# EAGLE schematic OliPCBv1 (EAGLE 9.6.2)
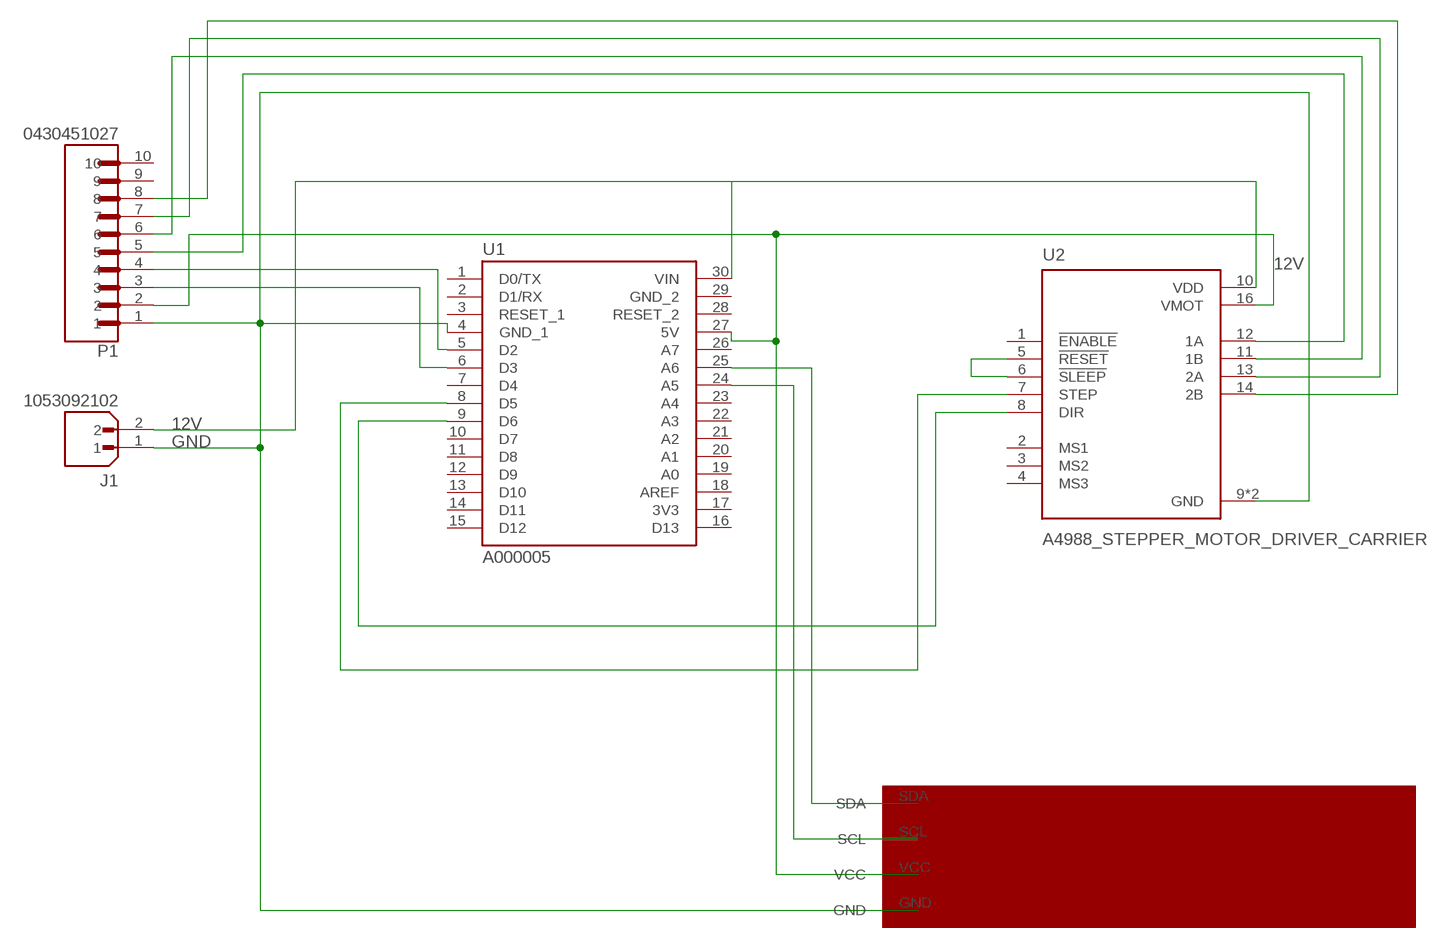
[diagram p0: schematic, sheet 1]

## Parts
J1  1053092102  [MOLEX_1053092102]
P1  0430451027  [MOLEX_0430451027]
U1  A000005  [MODULE_A000005]
U2  A4988_STEPPER_MOTOR_DRIVER_CARRIER  [MODULE_A4988_STEPPER_MOTOR_DRIVER_CARRIER]
U$1  WYTP61_DEVICE  [WTYP61]

## Nets
12V: J1.2 U1.30(VIN) U2.10(VDD)
GND: J1.1 P1.1 U1.4(GND_1) U2.9(GND) U2.15(GND) U$1.GND
N$1: U1.9(D6) U2.8(DIR)
N$2: U1.8(D5) U2.7(STEP)
N$3: U1.24(A5) U$1.SCL
N$4: U1.25(A6) U$1.SDA
N$5: P1.2 U1.27(5V) U2.16(VMOT) U$1.VCC
N$6: P1.3 U1.6(D3)
N$7: P1.4 U1.5(D2)
N$8: P1.5 U2.12(1A)
N$10: P1.6 U2.11(1B)
N$11: P1.7 U2.13(2A)
N$12: P1.8 U2.14(2B)
N$13: U2.5(!RESET) U2.6(!SLEEP)
Unconnected: P1.9 P1.10 U1.1(D0/TX) U1.2(D1/RX) U1.3(RESET_1) U1.7(D4) U1.10(D7) U1.11(D8) U1.12(D9) U1.13(D10) U1.14(D11) U1.15(D12) U1.16(D13) U1.18(AREF) U1.19(A0) U1.20(A1) U1.21(A2) U1.22(A3) U1.23(A4) U1.26(A7) U1.28(RESET_2) U2.1(!ENABLE) U2.2(MS1) U2.3(MS2) U2.4(MS3)

## Power pins joined to a net without a drawn wire
3V3: U1.17(3V3)
GND_2: U1.29(GND_2)

## Library data of the parts
J1 = Molex Power:1053092102: Nano-Fit Vertical Header, Through Hole, 2.50mm Pitch, Single Row, 2 Circuits, with Kinked Pins, Tin (Sn) Plating, Black, Glow-Wire Capable, Tray Check availability <https://pricing.snapeda.com/parts/1053092102/Molex/view-part?ref=eda>; AVAILABILITY: In Stock; DESCRIPTION: Connector Header Through Hole 2 position 0.098 (2.50mm); MF: Molex; MP: 1053092102; PACKAGE: None; PRICE: None; PURCHASE-URL: https://pricing.snapeda.com/search/part/1053092102/?ref=eda
P1 = Molex:0430451027: Conn Power HDR 10 POS 3mm Solder ST Thru-Hole 10 Terminal 1 Port Micro-Fit 3.0; MANUFACTURER: Molex
U1 = A000005:A000005: CLOCK SAW OSCILLATOR SEAM7050 T& Check availability <https://pricing.snapeda.com/parts/A000005/Arduino/view-part?ref=eda>; AVAILABILITY: In Stock; DESCRIPTION: Small, complete, and breadboard-friendly board based on the ATmega328 (Arduino Nano 3.x).; MF: Arduino; MP: A000005; PACKAGE: Non-Standard Arduino; PRICE: None; PURCHASE-URL: https://pricing.snapeda.com/search/part/A000005/?ref=eda
U2 = A4988_STEPPER_MOTOR_DRIVER_CARRIER:A4988_STEPPER_MOTOR_DRIVER_CARRIER: Stepper motor controler; IC: A4988; 1A; Uin mot: 8÷35V Check availability <https://pricing.snapeda.com/parts/A4988%20STEPPER%20MOTOR%20DRIVER%20CARRIER/Pololu/view-part?ref=eda>; AVAILABILITY: Not in stock; DESCRIPTION: Stepper Motor Driver; MF: Pololu; MP: A4988 STEPPER MOTOR DRIVER CARRIER; PACKAGE: None; PRICE: None
U$1 = WYTP61:WYTP61_DEVICE